# EAGLE design switch_box (EAGLE 6.2)
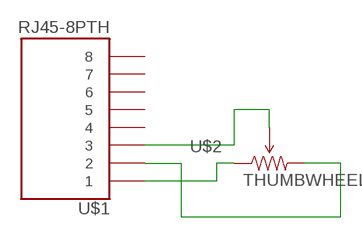
[diagram p0: schematic, sheet 1]

## Parts
U$1  RJ45-8PTH  [RJ45-8]
U$2  THUMBWHEEL  [THUMBWHEEL]

## Nets
N$1: U$1.1 U$2.1(CCW)
N$3: U$1.2 U$2.3(CW)
N$4: U$1.3 U$2.2(WIPER)
Unconnected: U$1.4 U$1.5 U$1.6 U$1.7 U$1.8

## Library data of the parts
U$1 = SparkFun:RJ45-8: RJ45 Jack Simple RJ45, 8-pin connection - connector for common Cat5, Cat5e, and Cat6 Ethernet cables. Footprint not yet proven in production. Connector sku is PRT-00643; Breakout PCB sku is BOB-00716.
U$2 = 7Seg Library:THUMBWHEEL

## Board
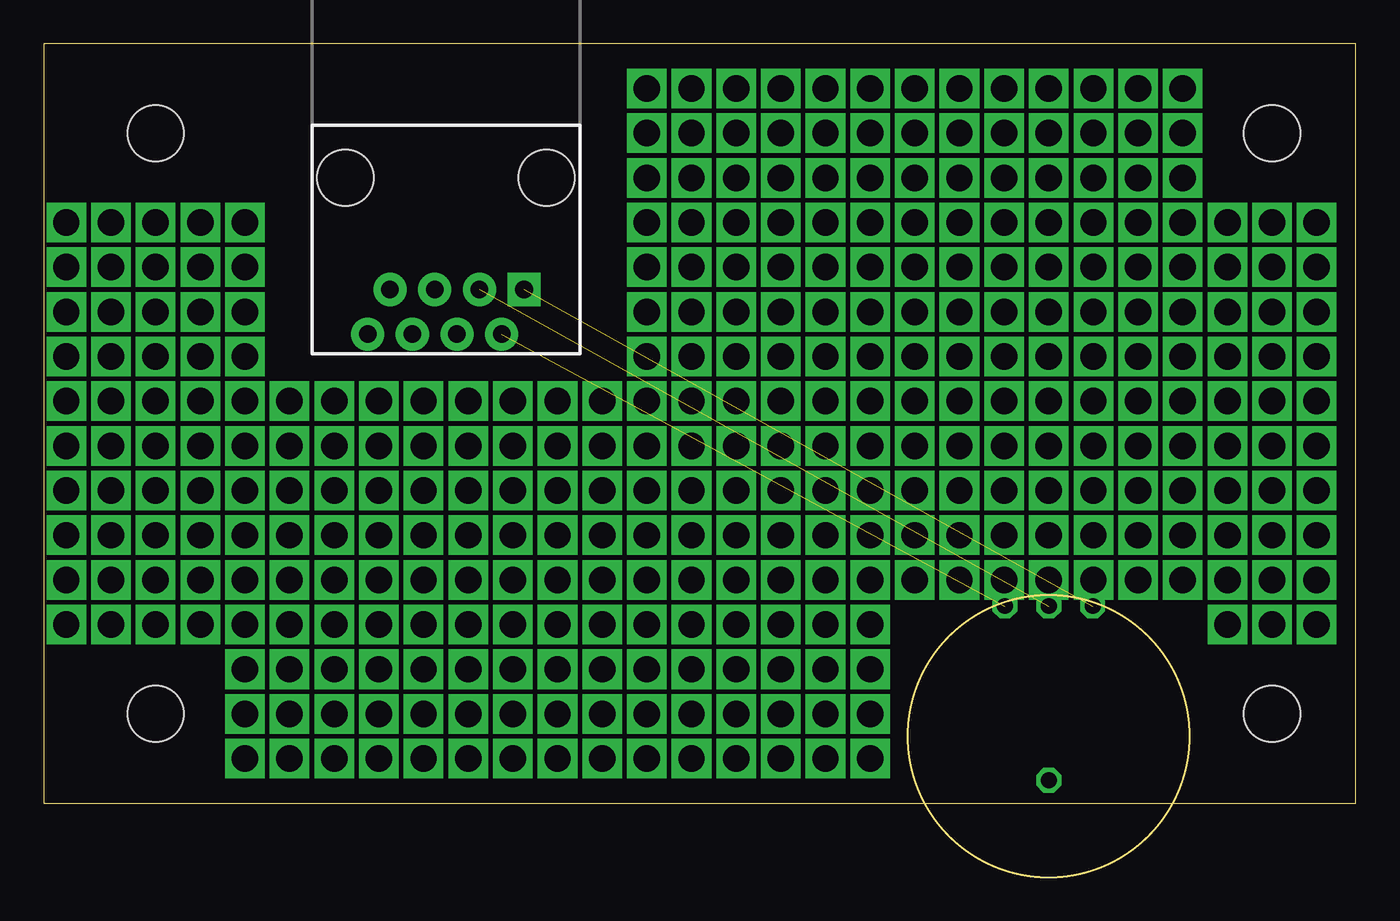
[diagram p1: board, top side]
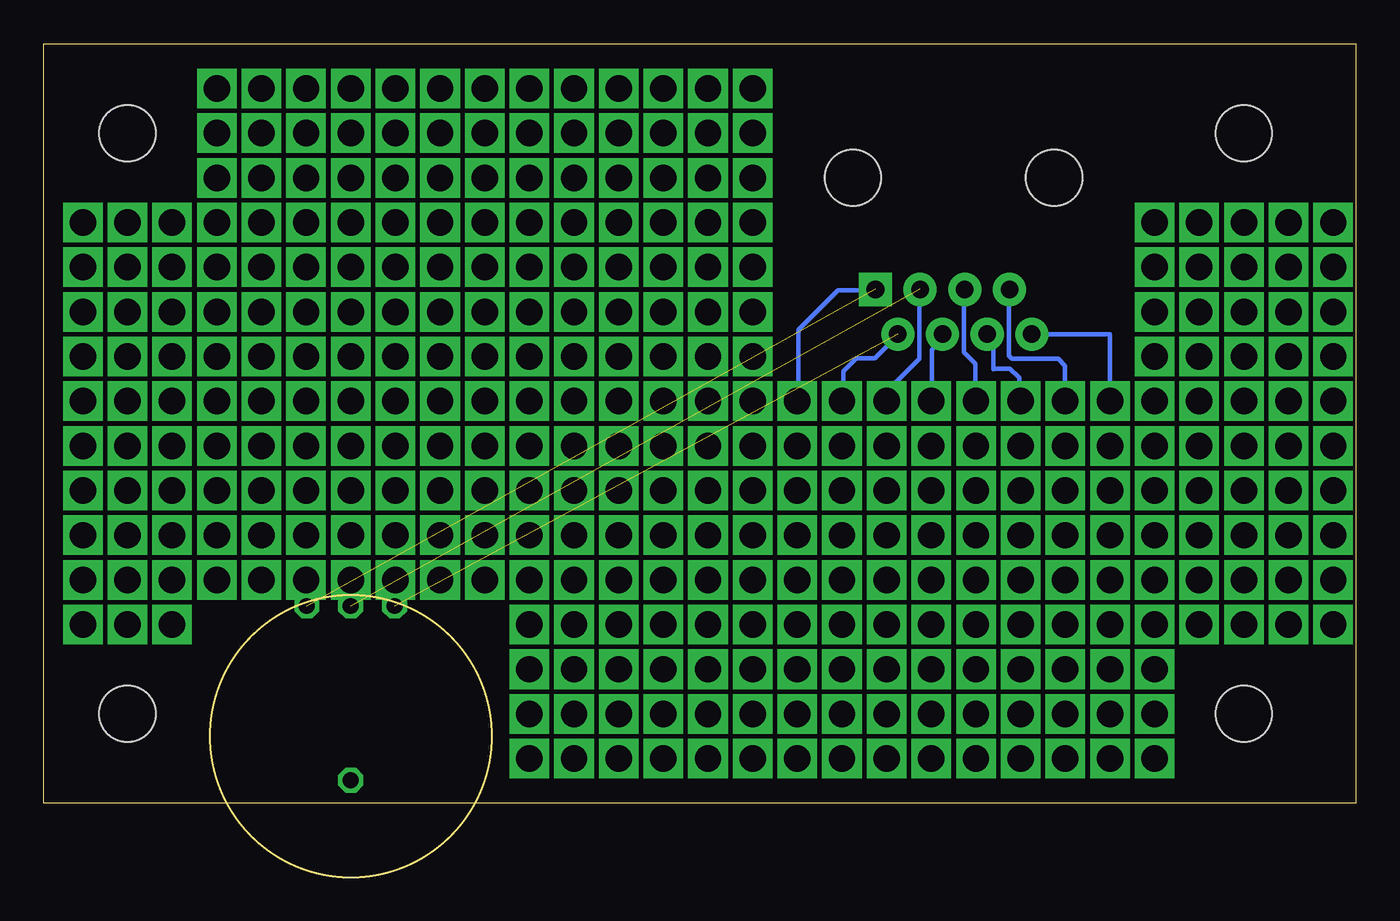
[diagram p2: board, bottom side, seen from below]

Size 74.6 x 43.17 mm. Coordinates in mm from the lower left corner, seen from the top.
Outline: 0,0 74.6,0 74.6,43.17 0,43.17 0,0
Copper layers (1*16): Top 0.035mm / dielectric 1.5mm / Bottom 0.035mm
Design rules: minimum track width 10mil, minimum drill 24mil, track to track 8mil, track to pad 8mil, pad to pad 8mil, via to via 8mil, smd to smd 8mil, copper to edge 40mil, drill to drill 8mil, minimum pad ring 10mil, minimum via ring 8mil, stop-mask expansion 4mil, vias tented up to drill 0mil, thermal gap 10mil
Holes 3.2 mm at 6.35,38.1 69.85,38.1 69.85,5.08 6.35,5.08

### Footprints (pad centres in the part's own frame; a part is rotated, then mirrored left to right if it is on the bottom)
RJ45-8 = drill 1 pad 1.88 square: 1 -4.445,6.35 | drill 1 pad 1.88: 2 -3.175,8.89; 3 -1.905,6.35; 4 -0.635,8.89; 5 0.635,6.35; 6 1.905,8.89; 7 3.175,6.35; 8 4.445,8.89 | hole 3.2: -5.715,0; 5.715,0
THUMBWHEEL = drill 0.9 octagon: 1 -2.5,-7.4; 2 0,-7.4; 3 2.5,-7.4; P$4 0,2.5

### Placement (x,y rotation side)
U$1  22.86,35.56 180 top
U$2  57.15,3.81 180 top

### Tracks (layer width: path | path; a pad name or v marks a point on that pad's centre or on a via)
N$1  (1 unrouted)
N$2  (via drill 1.5)
  other vias: 57.15,35.56
N$3  (1 unrouted)
N$4  (1 unrouted)
N$5  (via drill 1.5)
  other vias: 72.39,33.02
N$6  (via drill 1.5)
  other vias: 69.85,33.02
N$7  (via drill 1.5)
  other vias: 67.31,33.02
N$8  (via drill 1.5)
  other vias: 64.77,33.02
N$9  (via drill 1.5)
  other vias: 62.23,33.02
N$10  (via drill 1.5)
  other vias: 59.69,33.02
N$11  (via drill 1.5)
  other vias: 57.15,33.02
N$12  (via drill 1.5)
  other vias: 54.61,33.02
N$13  (via drill 1.5)
  other vias: 52.07,33.02
N$14  (via drill 1.5)
  other vias: 16.51,22.86
N$15  (via drill 1.5)
  other vias: 64.77,35.56
N$16  (via drill 1.5)
  other vias: 62.23,35.56
N$17  (via drill 1.5)
  other vias: 59.69,35.56
N$18  (via drill 1.5)
  other vias: 54.61,35.56
N$19  (via drill 1.5)
  other vias: 52.07,35.56
N$20  (via drill 1.5)
  other vias: 52.07,30.48
N$21  (via drill 1.5)
  other vias: 54.61,30.48
N$22  (via drill 1.5)
  other vias: 57.15,30.48
N$23  (via drill 1.5)
  other vias: 59.69,30.48
N$24  (via drill 1.5)
  other vias: 62.23,30.48
N$25  (via drill 1.5)
  other vias: 64.77,30.48
N$26  (via drill 1.5)
  other vias: 67.31,30.48
N$27  (via drill 1.5)
  other vias: 69.85,30.48
N$28  (via drill 1.5)
  other vias: 72.39,30.48
N$29  (via drill 1.5)
  other vias: 72.39,25.4
N$30  (via drill 1.5)
  other vias: 69.85,25.4
N$31  (via drill 1.5)
  other vias: 67.31,25.4
N$32  (via drill 1.5)
  other vias: 64.77,25.4
N$33  (via drill 1.5)
  other vias: 62.23,25.4
N$34  (via drill 1.5)
  other vias: 72.39,27.94
N$35  (via drill 1.5)
  other vias: 69.85,27.94
N$36  (via drill 1.5)
  other vias: 67.31,27.94
N$37  (via drill 1.5)
  other vias: 64.77,27.94
N$38  (via drill 1.5)
  other vias: 62.23,27.94
N$39  (via drill 1.5)
  other vias: 62.23,22.86
N$40  (via drill 1.5)
  other vias: 64.77,22.86
N$41  (via drill 1.5)
  other vias: 67.31,22.86
N$42  (via drill 1.5)
  other vias: 69.85,22.86
N$43  (via drill 1.5)
  other vias: 72.39,22.86
N$44  (via drill 1.5)
  other vias: 59.69,25.4
N$45  (via drill 1.5)
  other vias: 57.15,25.4
N$46  (via drill 1.5)
  other vias: 54.61,25.4
N$47  (via drill 1.5)
  other vias: 52.07,25.4
N$48  (via drill 1.5)
  other vias: 49.53,25.4
N$49  (via drill 1.5)
  other vias: 46.99,25.4
N$50  (via drill 1.5)
  other vias: 44.45,25.4
N$51  (via drill 1.5)
  other vias: 59.69,27.94
N$52  (via drill 1.5)
  other vias: 57.15,27.94
N$53  (via drill 1.5)
  other vias: 54.61,27.94
N$54  (via drill 1.5)
  other vias: 52.07,27.94
N$55  (via drill 1.5)
  other vias: 49.53,27.94
N$56  (via drill 1.5)
  other vias: 46.99,27.94
N$57  (via drill 1.5)
  other vias: 44.45,27.94
N$58  (via drill 1.5)
  other vias: 44.45,22.86
N$59  (via drill 1.5)
  other vias: 46.99,22.86
N$60  (via drill 1.5)
  other vias: 49.53,22.86
N$61  (via drill 1.5)
  other vias: 52.07,22.86
N$62  (via drill 1.5)
  other vias: 54.61,22.86
N$63  (via drill 1.5)
  other vias: 57.15,22.86
N$64  (via drill 1.5)
  other vias: 59.69,22.86
N$65  (via drill 1.5)
  other vias: 59.69,17.78
N$66  (via drill 1.5)
  other vias: 57.15,17.78
N$67  (via drill 1.5)
  other vias: 54.61,17.78
N$68  (via drill 1.5)
  other vias: 59.69,20.32
N$69  (via drill 1.5)
  other vias: 57.15,20.32
N$70  (via drill 1.5)
  other vias: 54.61,20.32
N$71  (via drill 1.5)
  other vias: 54.61,15.24
N$72  (via drill 1.5)
  other vias: 57.15,15.24
N$73  (via drill 1.5)
  other vias: 59.69,15.24
N$74  (via drill 1.5)
  other vias: 49.53,40.64
N$75  (via drill 1.5)
  other vias: 46.99,40.64
N$76  (via drill 1.5)
  other vias: 44.45,40.64
N$77  (via drill 1.5)
  other vias: 41.91,40.64
N$78  (via drill 1.5)
  other vias: 39.37,40.64
N$79  (via drill 1.5)
  other vias: 36.83,40.64
N$80  (via drill 1.5)
  other vias: 34.29,40.64
N$81  (via drill 1.5)
  other vias: 54.61,12.7
N$82  (via drill 1.5)
  other vias: 57.15,12.7
N$83  (via drill 1.5)
  other vias: 59.69,12.7
N$84  (via drill 1.5)
  other vias: 72.39,17.78
N$85  (via drill 1.5)
  other vias: 69.85,17.78
N$86  (via drill 1.5)
  other vias: 72.39,20.32
N$87  (via drill 1.5)
  other vias: 69.85,20.32
N$88  (via drill 1.5)
  other vias: 34.29,38.1
N$89  (via drill 1.5)
  other vias: 36.83,38.1
N$90  (via drill 1.5)
  other vias: 39.37,38.1
N$91  (via drill 1.5)
  other vias: 41.91,38.1
N$92  (via drill 1.5)
  other vias: 44.45,38.1
N$93  (via drill 1.5)
  other vias: 46.99,38.1
N$94  (via drill 1.5)
  other vias: 49.53,38.1
N$95  (via drill 1.5)
  other vias: 49.53,33.02
N$96  (via drill 1.5)
  other vias: 46.99,33.02
N$97  (via drill 1.5)
  other vias: 44.45,33.02
N$98  (via drill 1.5)
  other vias: 49.53,35.56
N$99  (via drill 1.5)
  other vias: 46.99,35.56
N$100  (via drill 1.5)
  other vias: 44.45,35.56
N$101  (via drill 1.5)
  other vias: 44.45,30.48
N$102  (via drill 1.5)
  other vias: 46.99,30.48
N$103  (via drill 1.5)
  other vias: 49.53,30.48
N$104  (via drill 1.5)
  other vias: 41.91,33.02
N$105  (via drill 1.5)
  other vias: 39.37,33.02
N$106  (via drill 1.5)
  other vias: 36.83,33.02
N$107  (via drill 1.5)
  other vias: 34.29,33.02
N$108  (via drill 1.5)
  other vias: 41.91,35.56
N$109  (via drill 1.5)
  other vias: 39.37,35.56
N$110  (via drill 1.5)
  other vias: 36.83,35.56
N$111  (via drill 1.5)
  other vias: 34.29,35.56
N$112  (via drill 1.5)
  other vias: 34.29,30.48
N$113  (via drill 1.5)
  other vias: 36.83,30.48
N$114  (via drill 1.5)
  other vias: 39.37,30.48
N$115  (via drill 1.5)
  other vias: 41.91,30.48
N$116  (via drill 1.5)
  other vias: 52.07,17.78
N$117  (via drill 1.5)
  other vias: 49.53,17.78
N$118  (via drill 1.5)
  other vias: 46.99,17.78
N$119  (via drill 1.5)
  other vias: 44.45,17.78
N$120  (via drill 1.5)
  other vias: 41.91,17.78
N$121  (via drill 1.5)
  other vias: 39.37,17.78
N$122  (via drill 1.5)
  other vias: 52.07,20.32
N$123  (via drill 1.5)
  other vias: 49.53,20.32
N$124  (via drill 1.5)
  other vias: 46.99,20.32
N$125  (via drill 1.5)
  other vias: 44.45,20.32
N$126  (via drill 1.5)
  other vias: 41.91,20.32
N$127  (via drill 1.5)
  other vias: 39.37,20.32
N$128  (via drill 1.5)
  other vias: 39.37,15.24
N$129  (via drill 1.5)
  other vias: 41.91,15.24
N$130  (via drill 1.5)
  other vias: 44.45,15.24
N$131  (via drill 1.5)
  other vias: 46.99,15.24
N$132  (via drill 1.5)
  other vias: 49.53,15.24
N$133  (via drill 1.5)
  other vias: 52.07,15.24
N$134  (via drill 1.5)
  other vias: 69.85,15.24
N$135  (via drill 1.5)
  other vias: 72.39,15.24
N$136  (via drill 1.5)
  other vias: 52.07,12.7
N$137  (via drill 1.5)
  other vias: 49.53,12.7
N$138  (via drill 1.5)
  other vias: 72.39,10.16
N$139  (via drill 1.5)
  other vias: 69.85,10.16
N$140  (via drill 1.5)
  other vias: 46.99,10.16
N$141  (via drill 1.5)
  other vias: 44.45,10.16
N$142  (via drill 1.5)
  other vias: 41.91,10.16
N$143  (via drill 1.5)
  other vias: 39.37,10.16
N$144  (via drill 1.5)
  other vias: 36.83,10.16
N$145  (via drill 1.5)
  other vias: 34.29,10.16
N$146  (via drill 1.5)
  other vias: 31.75,10.16
N$147  (via drill 1.5)
  other vias: 46.99,12.7
N$148  (via drill 1.5)
  other vias: 44.45,12.7
N$149  (via drill 1.5)
  other vias: 41.91,12.7
N$150  (via drill 1.5)
  other vias: 39.37,12.7
N$151  (via drill 1.5)
  other vias: 36.83,12.7
N$152  (via drill 1.5)
  other vias: 34.29,12.7
N$153  (via drill 1.5)
  other vias: 31.75,12.7
N$154  (via drill 1.5)
  other vias: 31.75,7.62
N$155  (via drill 1.5)
  other vias: 34.29,7.62
N$156  (via drill 1.5)
  other vias: 36.83,7.62
N$157  (via drill 1.5)
  other vias: 39.37,7.62
N$158  (via drill 1.5)
  other vias: 41.91,7.62
N$159  (via drill 1.5)
  other vias: 44.45,7.62
N$160  (via drill 1.5)
  other vias: 46.99,7.62
N$161  (via drill 1.5)
  other vias: 46.99,5.08
N$162  (via drill 1.5)
  other vias: 44.45,5.08
N$163  (via drill 1.5)
  other vias: 41.91,5.08
N$164  (via drill 1.5)
  other vias: 36.83,25.4
N$165  (via drill 1.5)
  other vias: 34.29,25.4
N$166  (via drill 1.5)
  other vias: 26.67,10.16
N$167  (via drill 1.5)
  other vias: 29.21,12.7
N$168  (via drill 1.5)
  other vias: 26.67,12.7
N$169  (via drill 1.5)
  other vias: 26.67,22.86
N$170  (via drill 1.5)
  other vias: 29.21,22.86
N$171  (via drill 1.5)
  other vias: 31.75,22.86
N$172  (via drill 1.5)
  other vias: 34.29,22.86
N$173  (via drill 1.5)
  other vias: 36.83,22.86
N$174  (via drill 1.5)
  other vias: 36.83,17.78
N$175  (via drill 1.5)
  other vias: 34.29,17.78
N$176  (via drill 1.5)
  other vias: 31.75,17.78
N$177  (via drill 1.5)
  other vias: 36.83,20.32
N$178  (via drill 1.5)
  other vias: 34.29,20.32
N$179  (via drill 1.5)
  other vias: 31.75,20.32
N$180  (via drill 1.5)
  other vias: 31.75,15.24
N$181  (via drill 1.5)
  other vias: 34.29,15.24
N$182  (via drill 1.5)
  other vias: 36.83,15.24
N$183  (via drill 1.5)
  other vias: 29.21,17.78
N$184  (via drill 1.5)
  other vias: 26.67,17.78
N$185  (via drill 1.5)
  other vias: 29.21,20.32
N$186  (via drill 1.5)
  other vias: 26.67,20.32
N$187  (via drill 1.5)
  other vias: 26.67,15.24
N$188  (via drill 1.5)
  other vias: 29.21,15.24
N$189  (via drill 1.5)
  other vias: 36.83,27.94
N$190  (via drill 1.5)
  other vias: 39.37,27.94
N$191  (via drill 1.5)
  other vias: 41.91,27.94
N$192  (via drill 1.5)
  other vias: 44.45,27.94
N$193  (via drill 1.5)
  other vias: 46.99,27.94
N$194  (via drill 1.5)
  other vias: 46.99,22.86
N$195  (via drill 1.5)
  other vias: 46.99,25.4
N$196  (via drill 1.5)
  other vias: 44.45,22.86
N$197  (via drill 1.5)
  other vias: 41.91,22.86
N$198  (via drill 1.5)
  other vias: 39.37,22.86
N$199  (via drill 1.5)
  other vias: 36.83,22.86
N$200  (via drill 1.5)
  other vias: 34.29,22.86
N$201  (via drill 1.5)
  other vias: 44.45,25.4
N$202  (via drill 1.5)
  other vias: 41.91,25.4
N$203  (via drill 1.5)
  other vias: 39.37,25.4
N$204  (via drill 1.5)
  other vias: 36.83,25.4
N$205  (via drill 1.5)
  other vias: 34.29,25.4
N$206  (via drill 1.5)
  other vias: 34.29,27.94
N$207  (via drill 1.5)
  other vias: 24.13,20.32
N$208  (via drill 1.5)
  other vias: 21.59,20.32
N$209  (via drill 1.5)
  other vias: 19.05,20.32
N$210  (via drill 1.5)
  other vias: 16.51,20.32
N$211  (via drill 1.5)
  other vias: 24.13,22.86
N$212  (via drill 1.5)
  other vias: 21.59,22.86
N$213  (via drill 1.5)
  other vias: 19.05,22.86
N$214
  Bottom 0.254: 26.09,26.55 27.34,25.3 28.39,25.3 29.13,24.55 29.13,22.76
N$215  (via drill 1.5)
  other vias: 16.51,17.78
N$216  (via drill 1.5)
  other vias: 19.05,17.78
N$217  (via drill 1.5)
  other vias: 21.59,17.78
N$218  (via drill 1.5)
  other vias: 24.13,17.78
N$219  (via drill 1.5)
  other vias: 24.13,12.7
N$220  (via drill 1.5)
  other vias: 21.59,12.7
N$221  (via drill 1.5)
  other vias: 19.05,12.7
N$222  (via drill 1.5)
  other vias: 16.51,12.7
N$223  (via drill 1.5)
  other vias: 13.97,12.7
N$224  (via drill 1.5)
  other vias: 11.43,12.7
N$225  (via drill 1.5)
  other vias: 8.89,12.7
N$226  (via drill 1.5)
  other vias: 24.13,15.24
N$227  (via drill 1.5)
  other vias: 21.59,15.24
N$228  (via drill 1.5)
  other vias: 19.05,15.24
N$229  (via drill 1.5)
  other vias: 16.51,15.24
N$230  (via drill 1.5)
  other vias: 13.97,15.24
N$231  (via drill 1.5)
  other vias: 11.43,15.24
N$232  (via drill 1.5)
  other vias: 8.89,15.24
N$233  (via drill 1.5)
  other vias: 8.89,10.16
N$234  (via drill 1.5)
  other vias: 11.43,10.16
N$235  (via drill 1.5)
  other vias: 13.97,10.16
N$236  (via drill 1.5)
  other vias: 16.51,10.16
N$237  (via drill 1.5)
  other vias: 19.05,10.16
N$238  (via drill 1.5)
  other vias: 21.59,10.16
N$239  (via drill 1.5)
  other vias: 24.13,10.16
N$240  (via drill 1.5)
  other vias: 24.13,5.08
N$241  (via drill 1.5)
  other vias: 21.59,5.08
N$242  (via drill 1.5)
  other vias: 19.05,5.08
N$243  (via drill 1.5)
  other vias: 24.13,7.62
N$244  (via drill 1.5)
  other vias: 21.59,7.62
N$245  (via drill 1.5)
  other vias: 19.05,7.62
N$246  (via drill 1.5)
  other vias: 19.05,2.54
N$247  (via drill 1.5)
  other vias: 21.59,2.54
N$248  (via drill 1.5)
  other vias: 24.13,2.54
N$249  (via drill 1.5)
  other vias: 13.97,20.32
N$250  (via drill 1.5)
  other vias: 11.43,20.32
N$251  (via drill 1.5)
  other vias: 8.89,20.32
N$252  (via drill 1.5)
  Bottom 0.254: v13.97,22.86 13.97,26.67 17.78,26.67
N$253  (via drill 1.5)
  other vias: 11.43,22.86
N$254  (via drill 1.5)
  other vias: 8.89,22.86
N$255  (via drill 1.5)
  other vias: 8.89,17.78
N$256  (via drill 1.5)
  other vias: 11.43,17.78
N$257  (via drill 1.5)
  other vias: 13.97,17.78
N$258  (via drill 1.5)
  other vias: 6.35,20.32
N$259  (via drill 1.5)
  other vias: 3.81,20.32
N$260  (via drill 1.5)
  other vias: 1.27,20.32
N$261  (via drill 1.5)
  other vias: 67.31,10.16
N$262  (via drill 1.5)
  other vias: 6.35,22.86
N$263  (via drill 1.5)
  other vias: 3.81,22.86
N$264  (via drill 1.5)
  other vias: 1.27,22.86
N$265
  Bottom 0.254: 19.62,29.14 19.7,29.05 19.7,25.45 19.53,25.27 16.92,25.27 16.53,24.88 16.53,22.79
N$266  (via drill 1.5)
  other vias: 72.39,12.7
N$267  (via drill 1.5)
  other vias: 1.27,17.78
N$268  (via drill 1.5)
  other vias: 3.81,17.78
N$269  (via drill 1.5)
  other vias: 6.35,17.78
N$270  (via drill 1.5)
  other vias: 16.51,5.08
N$271  (via drill 1.5)
  other vias: 13.97,5.08
N$272  (via drill 1.5)
  other vias: 11.43,5.08
N$273  (via drill 1.5)
  other vias: 69.85,12.7
N$274  (via drill 1.5)
  other vias: 67.31,12.7
N$275  (via drill 1.5)
  other vias: 64.77,12.7
N$276  (via drill 1.5)
  other vias: 16.51,7.62
N$277  (via drill 1.5)
  other vias: 13.97,7.62
N$278  (via drill 1.5)
  other vias: 11.43,7.62
N$279
  Bottom 0.254: 22.18,29.21 22.27,29.12 22.27,25.66 21.62,25 21.62,22.82
N$280
  Bottom 0.254: 23.32,26.55 24.09,25.78 24.09,22.94
N$281
  Bottom 0.254: 24.81,29.27 24.81,25.27 26.6,23.48 26.6,23.33
N$282
  Bottom 0.254: 27.4,29.12 27.46,29.18 29.43,29.18 31.7,26.91 31.7,22.76
N$283
  Bottom 0.254: 20.95,26.58 20.61,26.23 20.61,24.68 20.58,24.71 19.65,24.71 19.12,24.18 19.12,22.68
N$285  (via drill 1.5)
  other vias: 11.43,2.54
N$286  (via drill 1.5)
  other vias: 13.97,2.54
N$287  (via drill 1.5)
  other vias: 16.51,2.54
N$288  (via drill 1.5)
  other vias: 1.27,12.7
N$290  (via drill 1.5)
  other vias: 67.31,17.78
N$291  (via drill 1.5)
  other vias: 1.27,10.16
N$292  (via drill 1.5)
  other vias: 64.77,17.78
N$293  (via drill 1.5)
  other vias: 67.31,20.32
N$294  (via drill 1.5)
  other vias: 64.77,20.32
N$295  (via drill 1.5)
  other vias: 64.77,15.24
N$296  (via drill 1.5)
  other vias: 67.31,15.24
N$298  (via drill 1.5)
  other vias: 1.27,15.24
N$299  (via drill 1.5)
  other vias: 3.81,15.24
N$300  (via drill 1.5)
  other vias: 6.35,15.24
N$301  (via drill 1.5)
  other vias: 8.89,15.24
N$302  (via drill 1.5)
  other vias: 11.43,15.24
N$303  (via drill 1.5)
  other vias: 11.43,10.16
N$304  (via drill 1.5)
  other vias: 11.43,12.7
N$305  (via drill 1.5)
  other vias: 8.89,10.16
N$306  (via drill 1.5)
  other vias: 6.35,10.16
N$307  (via drill 1.5)
  other vias: 3.81,10.16
N$308  (via drill 1.5)
  other vias: 1.27,10.16
N$310  (via drill 1.5)
  other vias: 8.89,12.7
N$311  (via drill 1.5)
  other vias: 6.35,12.7
N$312  (via drill 1.5)
  other vias: 3.81,12.7
N$313  (via drill 1.5)
  other vias: 1.27,12.7
N$316  (via drill 1.5)
  other vias: 11.43,30.48
N$317  (via drill 1.5)
  other vias: 8.89,30.48
N$318  (via drill 1.5)
  other vias: 11.43,33.02
N$319  (via drill 1.5)
  other vias: 8.89,33.02
N$320  (via drill 1.5)
  other vias: 8.89,27.94
N$321  (via drill 1.5)
  other vias: 11.43,27.94
N$327  (via drill 1.5)
  other vias: 64.77,12.7
N$330  (via drill 1.5)
  other vias: 64.77,40.64
N$331  (via drill 1.5)
  other vias: 64.77,38.1
N$332  (via drill 1.5)
  other vias: 64.77,35.56
N$333  (via drill 1.5)
  other vias: 62.23,40.64
N$334  (via drill 1.5)
  other vias: 62.23,38.1
N$335  (via drill 1.5)
  other vias: 62.23,35.56
N$337  (via drill 1.5)
  other vias: 11.43,25.4
N$338  (via drill 1.5)
  other vias: 8.89,25.4
N$339  (via drill 1.5)
  other vias: 6.35,25.4
N$340  (via drill 1.5)
  other vias: 3.81,25.4
N$341  (via drill 1.5)
  other vias: 1.27,30.48
N$342  (via drill 1.5)
  other vias: 1.27,27.94
N$343  (via drill 1.5)
  other vias: 1.27,25.4
N$344  (via drill 1.5)
  other vias: 1.27,33.02
N$345  (via drill 1.5)
  other vias: 3.81,33.02
N$346  (via drill 1.5)
  other vias: 6.35,33.02
N$347  (via drill 1.5)
  other vias: 8.89,33.02
N$348  (via drill 1.5)
  other vias: 11.43,33.02
N$349  (via drill 1.5)
  other vias: 11.43,27.94
N$350  (via drill 1.5)
  other vias: 11.43,30.48
N$351  (via drill 1.5)
  other vias: 8.89,27.94
N$352  (via drill 1.5)
  other vias: 6.35,27.94
N$353  (via drill 1.5)
  other vias: 3.81,27.94
N$354  (via drill 1.5)
  other vias: 1.27,27.94
N$355  (via drill 1.5)
  other vias: 8.89,30.48
N$356  (via drill 1.5)
  other vias: 6.35,30.48
N$357  (via drill 1.5)
  other vias: 3.81,30.48
N$358  (via drill 1.5)
  other vias: 1.27,30.48
N$361  (via drill 1.5)
  other vias: 52.07,35.56
N$362  (via drill 1.5)
  other vias: 52.07,38.1
N$363  (via drill 1.5)
  other vias: 52.07,40.64
N$364  (via drill 1.5)
  other vias: 57.15,40.64
N$365  (via drill 1.5)
  other vias: 57.15,38.1
N$366  (via drill 1.5)
  other vias: 57.15,35.56
N$367  (via drill 1.5)
  other vias: 54.61,40.64
N$368  (via drill 1.5)
  other vias: 54.61,38.1
N$369  (via drill 1.5)
  other vias: 54.61,35.56
N$370  (via drill 1.5)
  other vias: 59.69,35.56
N$371  (via drill 1.5)
  other vias: 59.69,38.1
N$372  (via drill 1.5)
  other vias: 59.69,40.64
N$379  (via drill 1.5)
  other vias: 62.23,35.56
N$380  (via drill 1.5)
  other vias: 62.23,38.1
N$382  (via drill 1.5)
  other vias: 64.77,38.1
N$384  (via drill 1.5)
  other vias: 64.77,35.56
N$385  (via drill 1.5)
  other vias: 29.21,10.16
N$386  (via drill 1.5)
  other vias: 29.21,7.62
N$387  (via drill 1.5)
  other vias: 26.67,7.62
N$388  (via drill 1.5)
  other vias: 62.23,20.32
N$389  (via drill 1.5)
  other vias: 62.23,17.78
N$390  (via drill 1.5)
  other vias: 62.23,15.24
N$391  (via drill 1.5)
  other vias: 62.23,12.7
N$392  (via drill 1.5)
  other vias: 46.99,10.16
N$393  (via drill 1.5)
  other vias: 44.45,10.16
N$394  (via drill 1.5)
  other vias: 44.45,7.62
N$395  (via drill 1.5)
  other vias: 46.99,7.62
N$396  (via drill 1.5)
  other vias: 46.99,2.54
N$397  (via drill 1.5)
  other vias: 44.45,2.54
N$398  (via drill 1.5)
  other vias: 41.91,2.54
N$399  (via drill 1.5)
  other vias: 39.37,2.54
N$400  (via drill 1.5)
  other vias: 36.83,2.54
N$401  (via drill 1.5)
  other vias: 46.99,5.08
N$402  (via drill 1.5)
  other vias: 44.45,5.08
N$403  (via drill 1.5)
  other vias: 41.91,5.08
N$404  (via drill 1.5)
  other vias: 39.37,5.08
N$405  (via drill 1.5)
  other vias: 36.83,5.08
N$406  (via drill 1.5)
  other vias: 31.75,2.54
N$407  (via drill 1.5)
  other vias: 34.29,5.08
N$408  (via drill 1.5)
  other vias: 31.75,5.08
N$409  (via drill 1.5)
  other vias: 41.91,10.16
N$410  (via drill 1.5)
  other vias: 39.37,10.16
N$411  (via drill 1.5)
  other vias: 36.83,10.16
N$412  (via drill 1.5)
  other vias: 36.83,7.62
N$413  (via drill 1.5)
  other vias: 39.37,7.62
N$414  (via drill 1.5)
  other vias: 41.91,7.62
N$415  (via drill 1.5)
  other vias: 34.29,10.16
N$416  (via drill 1.5)
  other vias: 31.75,10.16
N$417  (via drill 1.5)
  other vias: 31.75,7.62
N$418  (via drill 1.5)
  other vias: 34.29,7.62
N$419  (via drill 1.5)
  other vias: 21.59,10.16
N$420  (via drill 1.5)
  other vias: 24.13,10.16
N$421  (via drill 1.5)
  other vias: 26.67,10.16
N$422  (via drill 1.5)
  other vias: 29.21,10.16
N$423  (via drill 1.5)
  other vias: 29.21,5.08
N$424  (via drill 1.5)
  other vias: 26.67,5.08
N$425  (via drill 1.5)
  other vias: 24.13,5.08
N$426  (via drill 1.5)
  other vias: 21.59,5.08
N$427  (via drill 1.5)
  other vias: 29.21,7.62
N$428  (via drill 1.5)
  other vias: 26.67,7.62
N$429  (via drill 1.5)
  other vias: 24.13,7.62
N$430  (via drill 1.5)
  other vias: 21.59,7.62
N$431  (via drill 1.5)
  other vias: 21.59,2.54
N$432  (via drill 1.5)
  other vias: 24.13,2.54
N$433  (via drill 1.5)
  other vias: 26.67,2.54
N$434  (via drill 1.5)
  other vias: 29.21,2.54
N$435  (via drill 1.5)
  other vias: 34.29,2.54